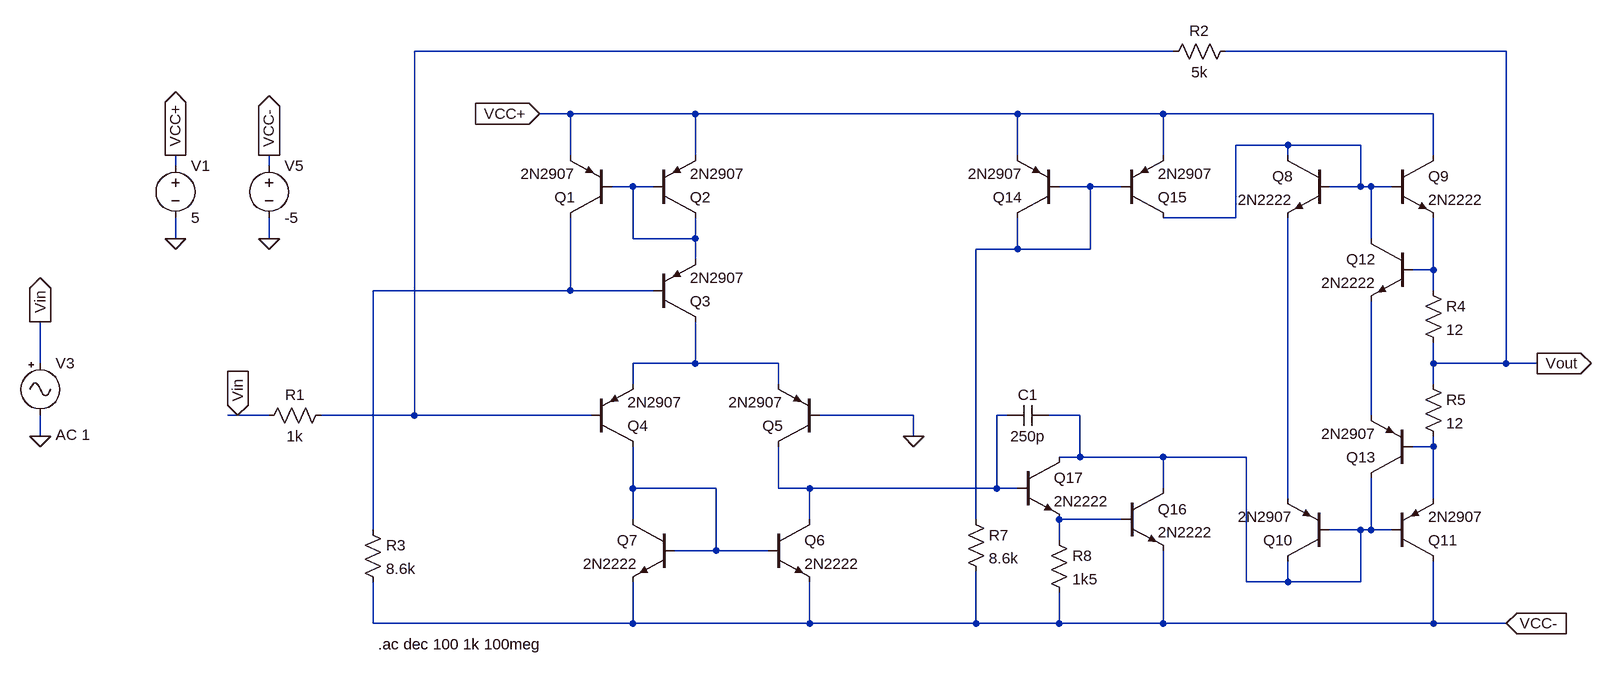
[diagram p0: schematic Draft13.asc]
Draft13.asc, the LTspice schematic file:
Version 4
SHEET 1 2516 1792
WIRE 1280 -288 112 -288
WIRE 1792 -288 1360 -288
WIRE 352 -192 304 -192
WIRE 544 -192 352 -192
WIRE 1040 -192 544 -192
WIRE 1264 -192 1040 -192
WIRE 1680 -192 1264 -192
WIRE 1456 -144 1376 -144
WIRE 1568 -144 1456 -144
WIRE 352 -128 352 -192
WIRE 544 -128 544 -192
WIRE 1040 -128 1040 -192
WIRE 1264 -128 1264 -192
WIRE 1456 -128 1456 -144
WIRE 1680 -128 1680 -192
WIRE -256 -112 -256 -128
WIRE -112 -112 -112 -128
WIRE 448 -80 416 -80
WIRE 480 -80 448 -80
WIRE 1152 -80 1104 -80
WIRE 1200 -80 1152 -80
WIRE 1568 -80 1568 -144
WIRE 1568 -80 1520 -80
WIRE 1584 -80 1568 -80
WIRE 1616 -80 1584 -80
WIRE 1376 -32 1376 -144
WIRE 1376 -32 1264 -32
WIRE -256 0 -256 -32
WIRE -112 0 -112 -32
WIRE 448 0 448 -80
WIRE 544 0 544 -32
WIRE 544 0 448 0
WIRE 1584 0 1584 -80
WIRE 1040 16 1040 -32
WIRE 1040 16 976 16
WIRE 1152 16 1152 -80
WIRE 1152 16 1040 16
WIRE 544 32 544 0
WIRE 1680 48 1680 -32
WIRE 1680 48 1648 48
WIRE 352 80 352 -32
WIRE 352 80 48 80
WIRE 480 80 352 80
WIRE 1680 80 1680 48
WIRE -464 192 -464 128
WIRE 544 192 544 128
WIRE 544 192 448 192
WIRE 672 192 544 192
WIRE 1680 192 1680 160
WIRE 1792 192 1792 -288
WIRE 1792 192 1680 192
WIRE 1840 192 1792 192
WIRE 448 224 448 192
WIRE 672 224 672 192
WIRE 1680 224 1680 192
WIRE -160 272 -176 272
WIRE -112 272 -160 272
WIRE 112 272 112 -288
WIRE 112 272 -32 272
WIRE 384 272 112 272
WIRE 880 272 736 272
WIRE 1024 272 1008 272
WIRE 1136 272 1088 272
WIRE 1584 272 1584 96
WIRE -464 304 -464 272
WIRE 880 304 880 272
WIRE 1680 320 1680 304
WIRE 1680 320 1648 320
WIRE 1136 336 1136 272
WIRE 1136 336 1104 336
WIRE 1264 336 1136 336
WIRE 1392 336 1264 336
WIRE 448 384 448 320
WIRE 576 384 448 384
WIRE 672 384 672 320
WIRE 720 384 672 384
WIRE 1008 384 1008 272
WIRE 1008 384 720 384
WIRE 1040 384 1008 384
WIRE 1264 384 1264 336
WIRE 1456 400 1456 -32
WIRE 1680 400 1680 320
WIRE 448 432 448 384
WIRE 720 432 720 384
WIRE 976 432 976 16
WIRE 1200 432 1104 432
WIRE 48 448 48 80
WIRE 1568 448 1520 448
WIRE 1584 448 1584 368
WIRE 1584 448 1568 448
WIRE 1616 448 1584 448
WIRE 1104 464 1104 432
WIRE 576 480 576 384
WIRE 576 480 512 480
WIRE 656 480 576 480
WIRE 1392 528 1392 336
WIRE 1456 528 1456 496
WIRE 1456 528 1392 528
WIRE 1568 528 1568 448
WIRE 1568 528 1456 528
WIRE 48 592 48 528
WIRE 448 592 448 528
WIRE 448 592 48 592
WIRE 720 592 720 528
WIRE 720 592 448 592
WIRE 976 592 976 512
WIRE 976 592 720 592
WIRE 1104 592 1104 544
WIRE 1104 592 976 592
WIRE 1264 592 1264 480
WIRE 1264 592 1104 592
WIRE 1680 592 1680 496
WIRE 1680 592 1264 592
WIRE 1792 592 1680 592
FLAG -112 0 0
FLAG 1840 192 Vout
IOPIN 1840 192 Out
FLAG -464 304 0
FLAG 1792 592 VCC-
IOPIN 1792 592 In
FLAG -112 -128 VCC-
IOPIN -112 -128 Out
FLAG -256 0 0
FLAG -256 -128 VCC+
IOPIN -256 -128 Out
FLAG -464 128 Vin
IOPIN -464 128 Out
FLAG 304 -192 VCC+
IOPIN 304 -192 In
FLAG 880 304 0
FLAG -160 272 Vin
IOPIN -160 272 In
SYMBOL voltage -256 -128 R0
SYMATTR InstName V1
SYMATTR Value 5
SYMBOL pnp 416 -32 R180
SYMATTR InstName Q1
SYMATTR Value 2N2907
SYMBOL pnp 480 -32 M180
SYMATTR InstName Q2
SYMATTR Value 2N2907
SYMBOL pnp 480 128 M180
SYMATTR InstName Q3
SYMATTR Value 2N2907
SYMBOL pnp 384 320 M180
SYMATTR InstName Q4
SYMATTR Value 2N2907
SYMBOL pnp 736 320 R180
SYMATTR InstName Q5
SYMATTR Value 2N2907
SYMBOL res 32 432 R0
SYMATTR InstName R3
SYMATTR Value 8.6k
SYMBOL npn 656 432 R0
SYMATTR InstName Q6
SYMATTR Value 2N2222
SYMBOL npn 512 432 M0
SYMATTR InstName Q7
SYMATTR Value 2N2222
SYMBOL Misc/signal -464 176 R0
WINDOW 3 24 104 Invisible 2
WINDOW 123 24 126 Left 2
SYMATTR Value SINE()
SYMATTR Value2 AC 1
SYMATTR InstName V3
SYMBOL npn 1520 -128 M0
SYMATTR InstName Q8
SYMATTR Value 2N2222
SYMBOL npn 1616 -128 R0
SYMATTR InstName Q9
SYMATTR Value 2N2222
SYMBOL pnp 1520 496 R180
SYMATTR InstName Q10
SYMATTR Value 2N2907
SYMBOL pnp 1616 496 M180
SYMATTR InstName Q11
SYMATTR Value 2N2907
SYMBOL voltage -112 -128 R0
SYMATTR InstName V5
SYMATTR Value -5
SYMBOL npn 1648 0 M0
SYMATTR InstName Q12
SYMATTR Value 2N2222
SYMBOL res 1664 64 R0
SYMATTR InstName R4
SYMATTR Value 12
SYMBOL pnp 1648 368 R180
SYMATTR InstName Q13
SYMATTR Value 2N2907
SYMBOL res 1664 208 R0
SYMATTR InstName R5
SYMATTR Value 12
SYMBOL pnp 1104 -32 R180
SYMATTR InstName Q14
SYMATTR Value 2N2907
SYMBOL pnp 1200 -32 M180
SYMATTR InstName Q15
SYMATTR Value 2N2907
SYMBOL npn 1200 384 R0
SYMATTR InstName Q16
SYMATTR Value 2N2222
SYMBOL npn 1040 336 R0
SYMATTR InstName Q17
SYMATTR Value 2N2222
SYMBOL res 960 416 R0
SYMATTR InstName R7
SYMATTR Value 8.6k
SYMBOL res 1088 448 R0
SYMATTR InstName R8
SYMATTR Value 1k5
SYMBOL cap 1088 256 R90
WINDOW 0 0 32 VBottom 2
WINDOW 3 32 32 VTop 2
SYMATTR InstName C1
SYMATTR Value 250p
SYMBOL res -16 256 R90
WINDOW 0 0 56 VBottom 2
WINDOW 3 32 56 VTop 2
SYMATTR InstName R1
SYMATTR Value 1k
SYMBOL res 1376 -304 R90
WINDOW 0 0 56 VBottom 2
WINDOW 3 32 56 VTop 2
SYMATTR InstName R2
SYMATTR Value 5k
TEXT 56 624 Left 2 !.ac dec 100 1k 100meg

The netlist it stands for:
* Draft13.asc
V1 VCC+ 0 5
Q1 N006 N003 VCC+ 0 2N2907
Q2 N003 N003 VCC+ 0 2N2907
Q3 N007 N006 N003 0 2N2907
Q4 N012 N001 N007 0 2N2907
Q5 N008 0 N007 0 2N2907
R3 N006 VCC- 8.6k
Q6 N008 N012 VCC- 0 2N2222
Q7 N012 N012 VCC- 0 2N2222
V3 Vin 0 SINE() AC 1
Q8 N002 N002 N013 0 2N2222
Q9 VCC+ N002 N005 0 2N2222
Q10 N009 N009 N013 0 2N2907
Q11 VCC- N009 N011 0 2N2907
V5 VCC- 0 -5
Q12 N002 N005 N010 0 2N2222
R4 N005 Vout 12
Q13 N009 N011 N010 0 2N2907
R5 Vout N011 12
Q14 N004 N004 VCC+ 0 2N2907
Q15 N002 N004 VCC+ 0 2N2907
Q16 N009 N014 VCC- 0 2N2222
Q17 N009 N008 N014 0 2N2222
R7 N004 VCC- 8.6k
R8 N014 VCC- 1k5
C1 N009 N008 250p
R1 N001 Vin 1k
R2 Vout N001 5k
.model NPN NPN
.model PNP PNP
.lib standard.bjt
.ac dec 100 1k 100meg
.backanno
.end